# EAGLE design BH_Pzem_WI_FI_SHIELD (EAGLE 8.6.0)
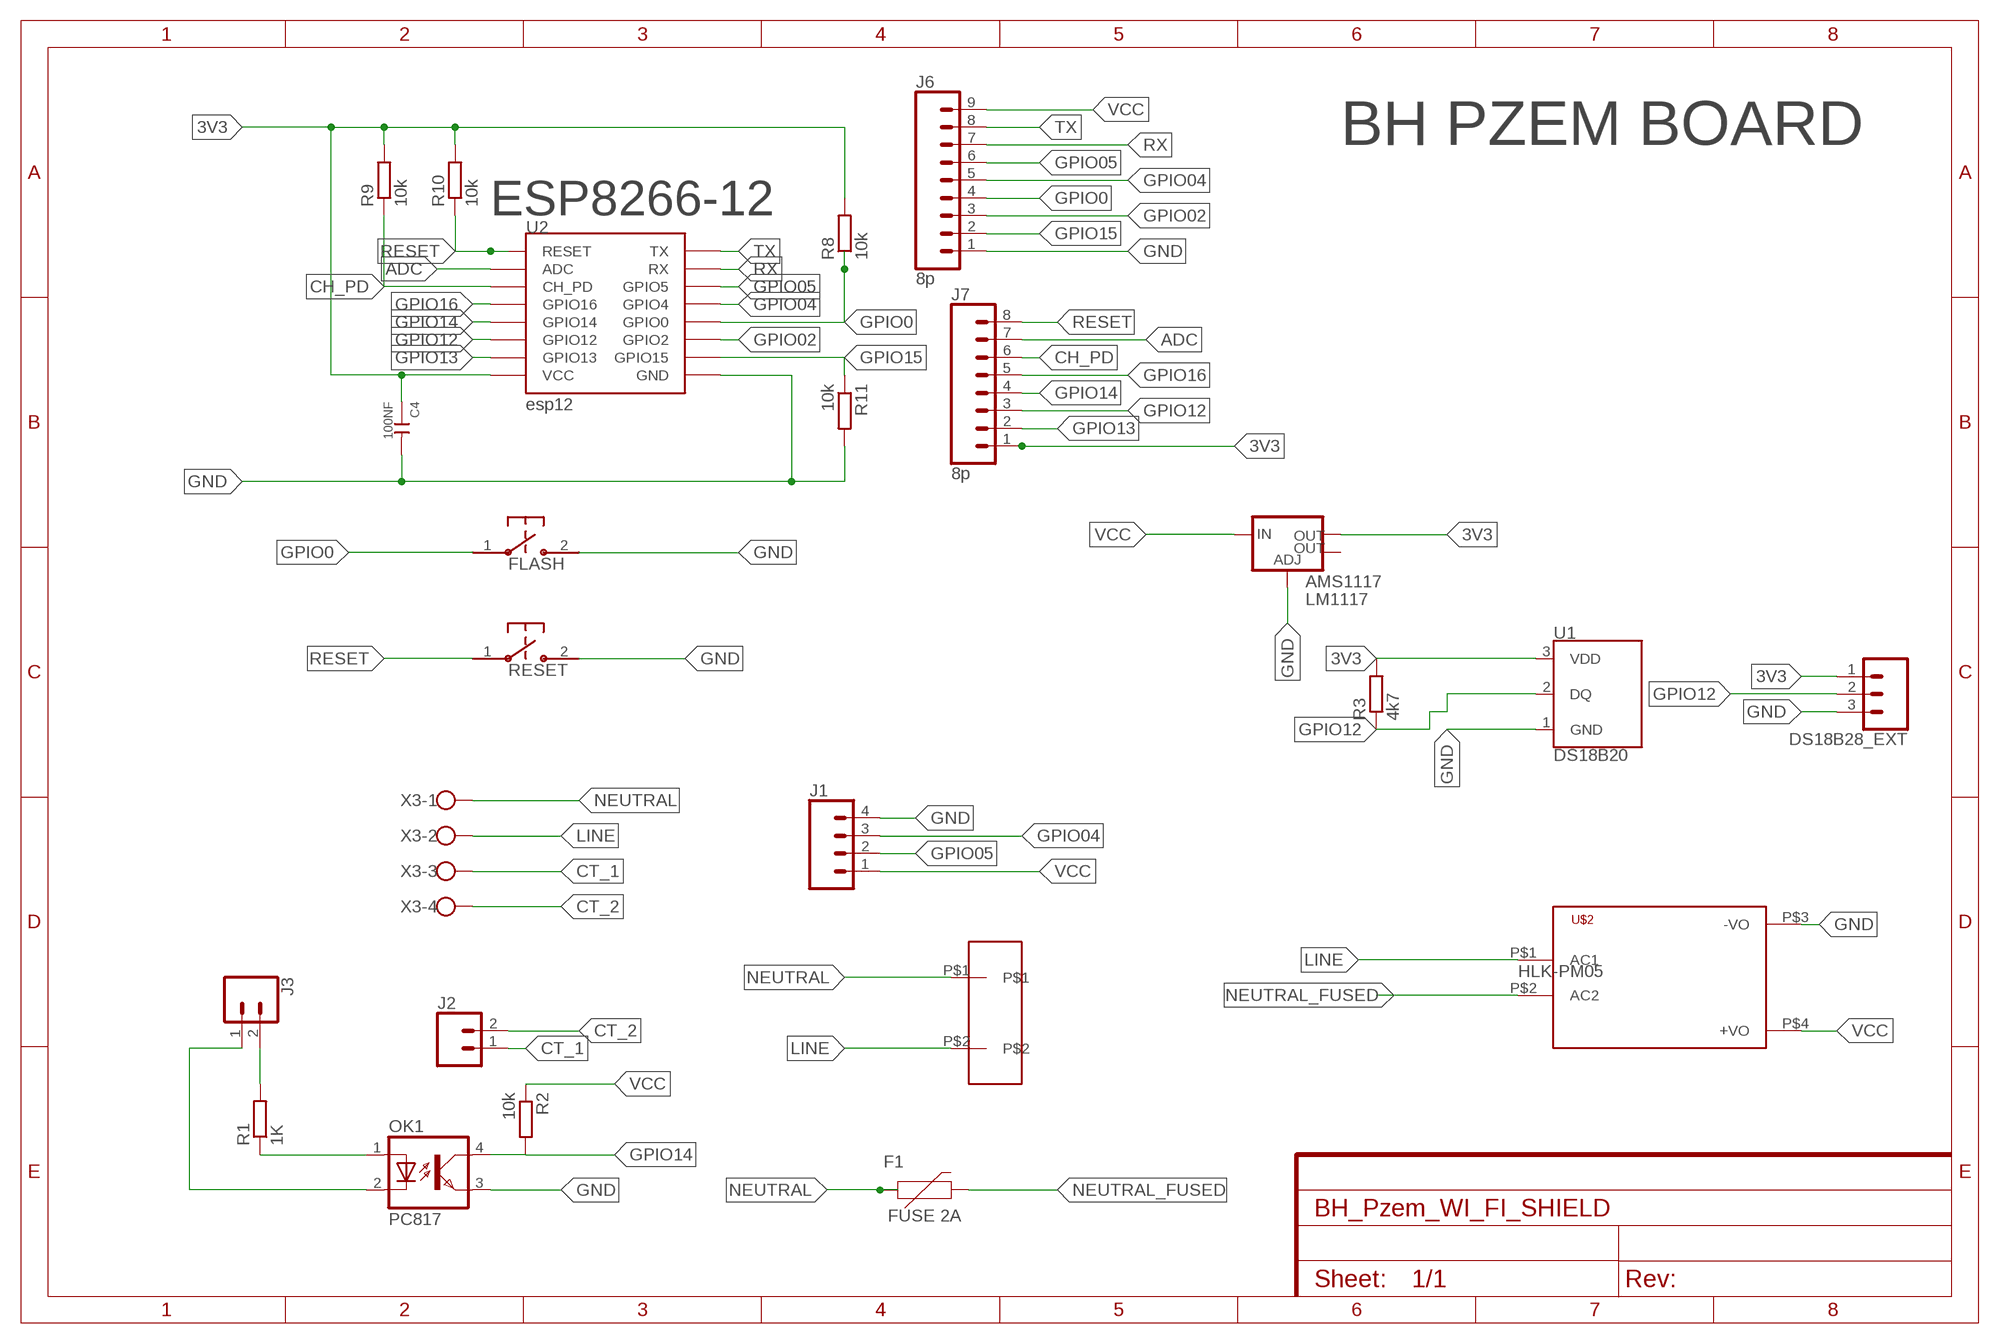
[diagram p0: schematic, sheet 1]

## Parts
AMS1117  LM1117  V_REG_LM1117SOT223  [SOT223]
C4  100NF  CERAMIC-1NF-1KV-10%-X7R(1206)  [C1206]
DS18B28_EXT  CONN_03  [1X03]
F1  FUSE 2A  PPTC_PTH  [PTH]
FLASH  B3U-1000P-2P-SMD  B3U-1000P  [B3U-1000P]
J1  CONN_04  [1X04]
J2  CONN_02  [1X02]
J3  CONN_02  [1X02]
J6  8p  CONN_09  [1X09]
J7  8p  CONN_08"  [1X08]
OK1  PC817  [DIL04]
R1  1K  R-EU_R0603  [R0603]
R2  10k  R-EU_R0603  [R0603]
R3  4k7  R-EU_R0603  [R0603]
R8  10k  R-EU_R0603  [R0603]
R9  10k  R-EU_R0603  [R0603]
R10  10k  R-EU_R0603  [R0603]
R11  10k  R-EU_R0603  [R0603]
RESET  B3U-1000P-2P-SMD  B3U-1000P  [B3U-1000P]
U1  DS18B20  [TO-92-AMMO]
U2  esp12  ESP12SMD  [ESP12-SMD]
U$1  SCREWTERMINALS_5MM_2  [TERMINAL_2X]
U$2  HKLPM01  [HKLPM01]
X3  W237-4  [W237-4]

## Nets
3V3: AMS1117.2(OUT) C4.1 DS18B28_EXT.1 J7.1 R3.2 R8.2 R9.2 R10.2 U1.3(VDD) U2.VCC
ADC: J7.7 U2.ADC
CH_PD: J7.6 R9.1 U2.CH_PD
CT_1: J2.1 X3.3
CT_2: J2.2 X3.4
GND: AMS1117.1(ADJ) C4.2 DS18B28_EXT.3 FLASH.2 J1.4 J6.1 OK1.3(EMIT) R11.2 RESET.2 U1.1(GND) U2.GND U$2.P$3(-VO)
GPIO0: FLASH.1 J6.4 R8.1 U2.GPIO0
GPIO02: J6.3 U2.GPIO2
GPIO04: J1.3 J6.5 U2.GPIO4
GPIO05: J1.2 J6.6 U2.GPIO5
GPIO12: DS18B28_EXT.2 J7.3 R3.1 U1.2(DQ) U2.GPIO12
GPIO13: J7.2 U2.GPIO13
GPIO14: J7.4 OK1.4(COL) R2.2 U2.GPIO14
GPIO15: J6.2 R11.1 U2.GPIO15
GPIO16: J7.5 U2.GPIO16
LINE: U$1.P$2 U$2.P$1(AC1) X3.2
N$1: OK1.1(A) R1.1
N$3: J3.2 R1.2
NEUTRAL [220V]: F1.P$1 U$1.P$1 X3.1
NEUTRAL_FUSED [220V]: F1.P$2 U$2.P$2(AC2)
RESET: J7.8 R10.1 RESET.1 U2.RESET
RX: J6.7 U2.RXD0(RX)
SIGNAL_GND: J3.1 OK1.2(C)
TX: J6.8 U2.TXD0(TX)
VCC: AMS1117.3(IN) J1.1 J6.9 R2.1 U$2.P$4(+VO)
Unconnected: AMS1117.4(OUT)

## Notes on the sheet
- BH PZEM BOARD
- ESP8266-12
- HLK-PM05

## Library data of the parts
AMS1117 = SparkFun-IC-Power:V_REG_LM1117: Voltage Regulator LM1117 Standard adjustable voltage regulator but in SMD form. Spark Fun Electronics SKU : COM-00595; PROD_ID: VREG-08170
C4 = Seeed-Capacitor:CERAMIC-1NF-1KV-10%-X7R?(1206): 302010189; MPN: CC1206KKX7RCBB102; VALUE: 1NF
DS18B28_EXT = SparkFun-Connectors:CONN_03: Multi connection point. Often used as Generic Header-pin footprint for 0.1 inch spaced/style header connections On any of the 0.1 inch spaced packages, you can populate with these: Break Away Headers - Straight <https://www.sparkfun.com/products/116> (PRT-00116) Break Away Male Headers - Right Angle <https://www.sparkfun.com/products/553> (PRT-00553) Female Headers <https://www.sparkfun.com/products/115> (PRT-00115) Break Away Headers - Machine Pin <https://www.sparkfun.com/products/117> (PRT-00117) Break Away Female Headers - Swiss Machine Pin <https://www.sparkfun.com/products/743> (PRT-00743) Stackable Header - 3 Pin (Female, 0.1") <https://www.sparkfun.com/products/13875> (PRT-13875) For SCREWTERMINALS and SPRING TERMINALS visit here: Screw Terimnals on SparkFun.com <https://www.sparkfun.com/search/results?term=Screw+Terminals> (5mm/3.5mm/2.54mm spacing) This device is also useful as a general connection point to wire up your design to another part of your project. Our various solder wires solder well into these plated through hole pads. Hook-Up Wire - Assortment (Stranded, 22 AWG) <https://www.sparkfun.com/products/11375> (PRT-11375) Hook-Up Wire - Assortment (Solid Core, 22 AWG) <https://www.sparkfun.com/products/11367> (PRT-11367) View the entire wire category on our website here <https://www.sparkfun.com/categories/141> Special notes: Molex polarized connector foot print use with SKU : PRT-08232 with associated crimp pins and housings.
F1 = SparkFun-Fuses:PPTC: Resettable Fuse PPTC Resettable Fuse. Really a sort of resistor with a polymeric positive temperature coefficient whose resistance increases dramatically with an increase in temperature. When heated by the power passing through the resistance rises causing the current to be limited, protecting the circuit. This is achieved by the transition of the polymer from a crystalline to an amorphous state where the conductive carbon separates breaking the conductive pathways found in the cool crystalline structure. When a PPTC cools back down it resumes conducting letting the circuit turn back on. SparkFun Products: SparkFun RedBoard - Programmed with Arduino <https://www.sparkfun.com/products/12757> Pro Micro - 5V/16MHz <https://www.sparkfun.com/products/12640> Arduino Pro 328 - 5V/16MHz <https://www.sparkfun.com/products/10915> MP3 Trigger <https://www.sparkfun.com/products/13720>; PROD_ID: RES-08490; VALUE: 72V/0.25A
FLASH = switches:B3U: Switch; DIGIKEY: SW1020CT-ND; MANUFACTURER: Omron; MPN: B3U-1000P; SPICEPREFIX: F
J1 = SparkFun-Connectors:CONN_04: Multi connection point. Often used as Generic Header-pin footprint for 0.1 inch spaced/style header connections On any of the 0.1 inch spaced packages, you can populate with these: Break Away Headers - Straight <https://www.sparkfun.com/products/116> (PRT-00116) Break Away Male Headers - Right Angle <https://www.sparkfun.com/products/553> (PRT-00553) Female Headers <https://www.sparkfun.com/products/115> (PRT-00115) Break Away Headers - Machine Pin <https://www.sparkfun.com/products/117> (PRT-00117) Break Away Female Headers - Swiss Machine Pin <https://www.sparkfun.com/products/743> (PRT-00743) For SCREWTERMINALS and SPRING TERMINALS visit here: Screw Terimnals on SparkFun.com <https://www.sparkfun.com/search/results?term=Screw+Terminals> (5mm/3.5mm/2.54mm spacing) This device is also useful as a general connection point to wire up your design to another part of your project. Our various solder wires solder well into these plated through hole pads. Hook-Up Wire - Assortment (Stranded, 22 AWG) <https://www.sparkfun.com/products/11375> (PRT-11375) Hook-Up Wire - Assortment (Solid Core, 22 AWG) <https://www.sparkfun.com/products/11367> (PRT-11367) View the entire wire category on our website here <https://www.sparkfun.com/categories/141> Special notes: Molex polarized connector foot print use with SKU : PRT-08231 with associated crimp pins and housings. 1MM SMD Version SKU: PRT-10208; PROD_ID: CONN-09696
J2 J3 = SparkFun-Connectors:CONN_02: Multi connection point. Often used as Generic Header-pin footprint for 0.1 inch spaced/style header connections On any of the 0.1 inch spaced packages, you can populate with these: Break Away Headers - Straight <https://www.sparkfun.com/products/116> (PRT-00116) Break Away Male Headers - Right Angle <https://www.sparkfun.com/products/553> (PRT-00553) Female Headers <https://www.sparkfun.com/products/115> (PRT-00115) Break Away Headers - Machine Pin <https://www.sparkfun.com/products/117> (PRT-00117) Break Away Female Headers - Swiss Machine Pin <https://www.sparkfun.com/products/743> (PRT-00743) For SCREWTERMINALS and SPRING TERMINALS visit here: Screw Terimnals on SparkFun.com <https://www.sparkfun.com/search/results?term=Screw+Terminals> (5mm/3.5mm/2.54mm spacing) This device is also useful as a general connection point to wire up your design to another part of your project. Our various solder wires solder well into these plated through hole pads. Hook-Up Wire - Assortment (Stranded, 22 AWG) <https://www.sparkfun.com/products/11375> (PRT-11375) Hook-Up Wire - Assortment (Solid Core, 22 AWG) <https://www.sparkfun.com/products/11367> (PRT-11367) View the entire wire category on our website here <https://www.sparkfun.com/categories/141> Special notes: Molex polarized connector foot print use with: PRT-08233 with associated crimp pins and housings. 2.54_SCREWTERM for use with PRT-10571. 3.5mm Screw Terminal footprints for PRT-08084 5mm Screw Terminal footprints for use with PRT-08432
J6 = SparkFun-Connectors:CONN_09: Multi connection point. Often used as Generic Header-pin footprint for 0.1 inch spaced/style header connections On any of the 0.1 inch spaced packages, you can populate with these: Break Away Headers - Straight <https://www.sparkfun.com/products/116> (PRT-00116) Break Away Male Headers - Right Angle <https://www.sparkfun.com/products/553> (PRT-00553) Female Headers <https://www.sparkfun.com/products/115> (PRT-00115) Break Away Headers - Machine Pin <https://www.sparkfun.com/products/117> (PRT-00117) Break Away Female Headers - Swiss Machine Pin <https://www.sparkfun.com/products/743> (PRT-00743) For SCREWTERMINALS and SPRING TERMINALS visit here: Screw Terimnals on SparkFun.com <https://www.sparkfun.com/search/results?term=Screw+Terminals> (5mm/3.5mm/2.54mm spacing) This device is also useful as a general connection point to wire up your design to another part of your project. Our various solder wires solder well into these plated through hole pads. Hook-Up Wire - Assortment (Stranded, 22 AWG) <https://www.sparkfun.com/products/11375> (PRT-11375) Hook-Up Wire - Assortment (Solid Core, 22 AWG) <https://www.sparkfun.com/products/11367> (PRT-11367) View the entire wire category on our website here <https://www.sparkfun.com/categories/141> Special notes: Molex polarized connector foot print use with SKU : PRT-08231 with associated crimp pins and housings. 1MM SMD Version SKU: PRT-10208 NOTES ON THE VARIANTS LOCK and LOCK_LONGPADS... This footprint was designed to help hold the alignment of a through-hole component (i.e. 6-pin header) while soldering it into place. You may notice that each hole has been shifted either up or down by 0.005 of an inch from it's more standard position (which is a perfectly straight line). This slight alteration caused the pins (the squares in the middle) to touch the edges of the holes. Because they are alternating, it causes a "brace" to hold the component in place. 0.005 has proven to be the perfect amount of "off-center" position when using our standard breakaway headers. Although looks a little odd when you look at the bare footprint, once you have a header in there, the alteration is very hard to notice. Also,if you push a header all the way into place, it is covered up entirely on the bottom side.
J7 = SparkFun-Connectors:CONN_08: Multi connection point. Often used as Generic Header-pin footprint for 0.1 inch spaced/style header connections On any of the 0.1 inch spaced packages, you can populate with these: Break Away Headers - Straight <https://www.sparkfun.com/products/116> (PRT-00116) Break Away Male Headers - Right Angle <https://www.sparkfun.com/products/553> (PRT-00553) Female Headers <https://www.sparkfun.com/products/115> (PRT-00115) Break Away Headers - Machine Pin <https://www.sparkfun.com/products/117> (PRT-00117) Break Away Female Headers - Swiss Machine Pin <https://www.sparkfun.com/products/743> (PRT-00743) Arduino Stackable Header - 8 Pin <https://www.sparkfun.com/products/9279> (PRT-09279) For SCREWTERMINALS and SPRING TERMINALS visit here: Screw Terimnals on SparkFun.com <https://www.sparkfun.com/search/results?term=Screw+Terminals> (5mm/3.5mm/2.54mm spacing) This device is also useful as a general connection point to wire up your design to another part of your project. Our various solder wires solder well into these plated through hole pads. Hook-Up Wire - Assortment (Stranded, 22 AWG) <https://www.sparkfun.com/products/11375> (PRT-11375) Hook-Up Wire - Assortment (Solid Core, 22 AWG) <https://www.sparkfun.com/products/11367> (PRT-11367) View the entire wire category on our website here <https://www.sparkfun.com/categories/141> Special notes: Molex polarized connector foot print use with SKU : PRT-08231 with associated crimp pins and housings. 1MM SMD Version SKU: PRT-10208 NOTES ON THE VARIANTS LOCK and LOCK_LONGPADS... This footprint was designed to help hold the alignment of a through-hole component (i.e. 6-pin header) while soldering it into place. You may notice that each hole has been shifted either up or down by 0.005 of an inch from it's more standard position (which is a perfectly straight line). This slight alteration caused the pins (the squares in the middle) to touch the edges of the holes. Because they are alternating, it causes a "brace" to hold the component in place. 0.005 has proven to be the perfect amount of "off-center" position when using our standard breakaway headers. Although looks a little odd when you look at the bare footprint, once you have a header in there, the alteration is very hard to notice. Also,if you push a header all the way into place, it is covered up entirely on the bottom side.; PROD_ID: CONN-08438
OK1 = optocoupler:PC817: SHARP OPTO COUPLER; MPN: PC817X4J000F; OC_FARNELL: 9707727; OC_NEWARK: 97K7059
R1-R3 R8-R11 = resistor:R-EU_: RESISTOR, European symbol
RESET = switches:B3U: Switch; DIGIKEY: SW1020CT-ND; MANUFACTURER: Omron; MPN: B3U-1000P
U1 = SparkFun-Sensors:DS18B20: Dallas/Maxim DS18B20 1-Wire Temperature Sensor The DS18B20 reports degrees C with 9 to 12-bit precision, -55C to 125C (+/-0.5C). Each sensor has a unique 64-Bit Serial number etched into it - allows for a huge number of sensors to be used on one data bus. Datasheet <http://datasheets.maximintegrated.com/en/ds/DS18B20.pdf> SparkFun Products One Wire Digital Temperature Sensor - DS18B20 <https://www.sparkfun.com/products/245> (SEN-00245); STORE_ID: SEN-00245
U2 = esp8266modules:ESP12: ESP8266 Wifi module 12
U$1 = captain-slow:SCREWTERMINALS_5MM_2
U$2 = HKLPM01:HKLPM01
X3 = con-wago-500:W237-4: WAGO SCREW CLAMP; OC_FARNELL: unknown; OC_NEWARK: unknown

## Net classes
1 220V: width 1.27 mm, clearance 2 mm

## Board
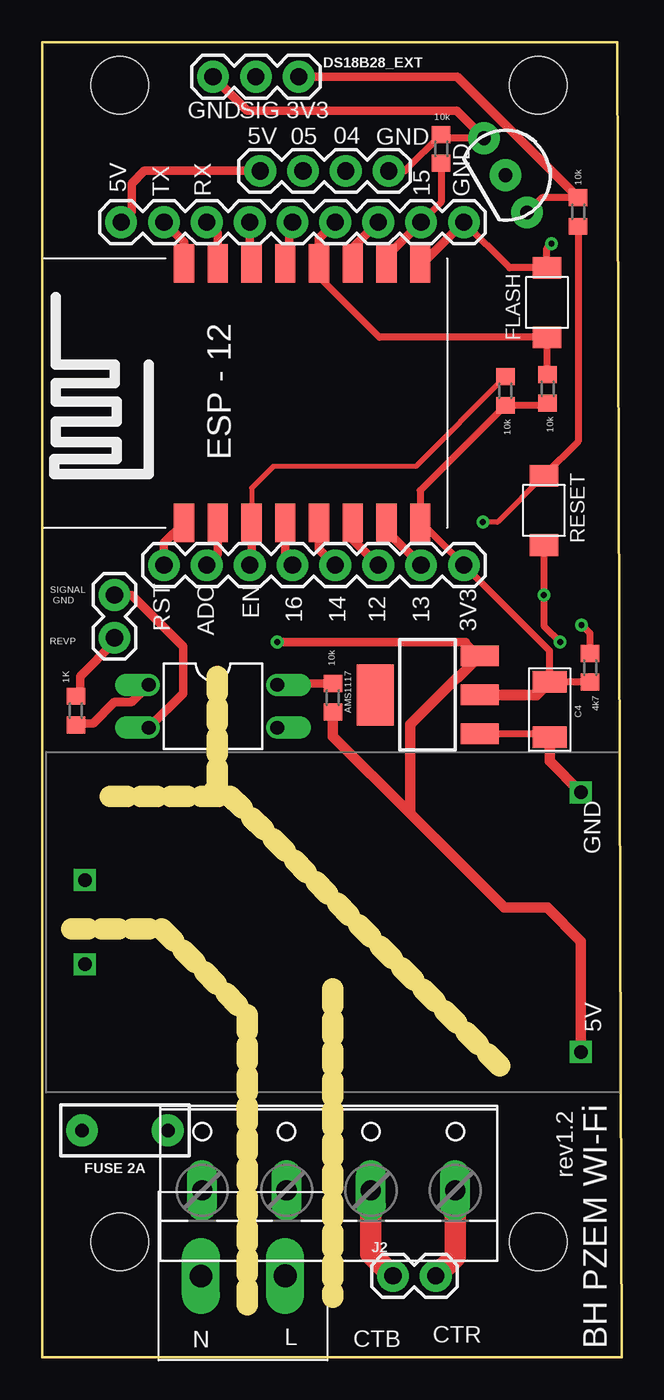
[diagram p1: board, top side]
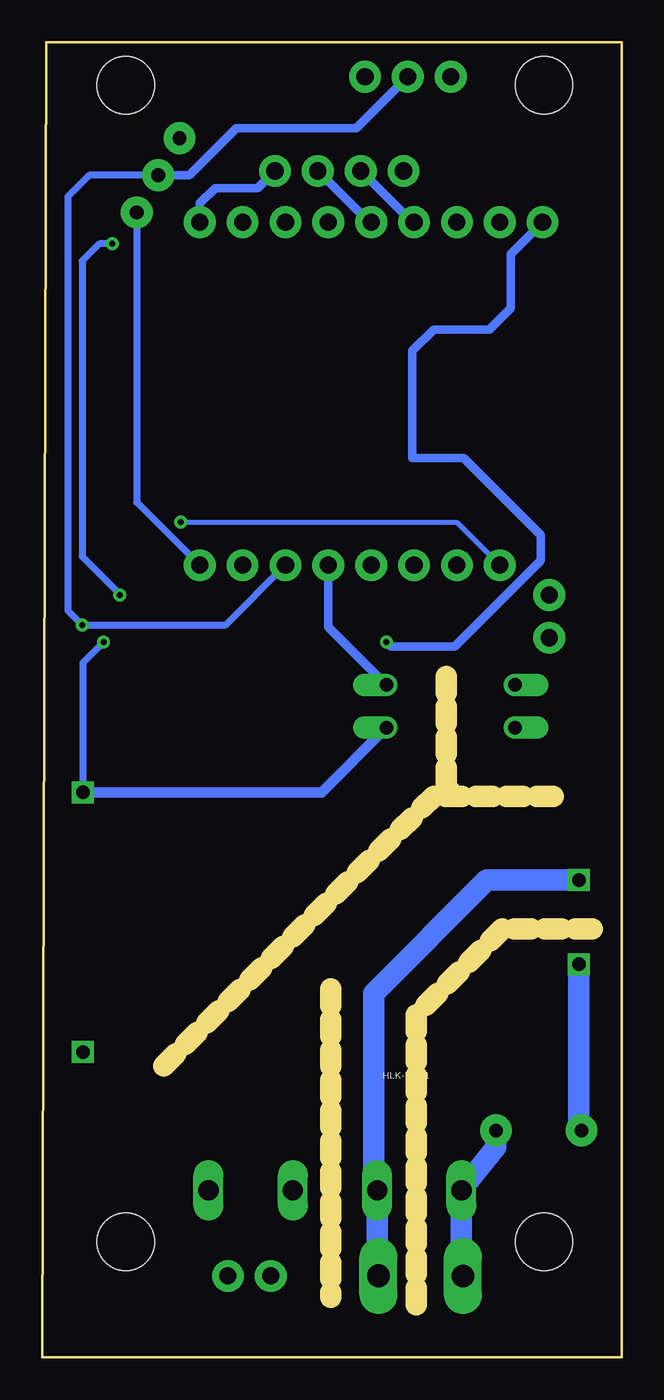
[diagram p2: board, bottom side, seen from below]

Size 34.34 x 77.99 mm. Coordinates in mm from the lower left corner, seen from the top.
Outline: 0,0 0,77.99 34.09,77.99 34.34,0 0,0
Copper layers (1*16): Top 0.035mm / dielectric 1.5mm / Bottom 0.035mm
Design rules "default": minimum track width 6mil, minimum drill 0.35mm, track to track 6mil, track to pad 6mil, pad to pad 6mil, via to via 6mil, smd to smd 6mil, copper to edge 40mil, drill to drill 6mil, minimum pad ring 10mil, minimum via ring 8mil, stop-mask expansion 4mil, vias tented up to drill 0mil, thermal gap 10mil
Holes 3.39 mm at 4.6,6.85 29.4,6.85 29.4,75.44 4.6,75.44
Milling: 50 lines

### Footprints (pad centres in the part's own frame; a part is rotated, then mirrored left to right if it is on the bottom)
SOT223 = smd 1.219 x 2.235: 1 -2.311,-3.099; 2 0,-3.099; 3 2.311,-3.099 | smd 3.6 x 2.2: 4 0,3.099
C1206 = smd 1.27 x 2.032: 1 -1.651,0; 2 1.651,0
1X03 = drill 1.016 pad 1.88: 1 0,0; 2 2.54,0; 3 5.08,0
PTH = drill 0.8 pad 1.88: P$1 -2.54,0; P$2 2.54,0
B3U-1000P = smd 1.283 x 1.7: 1 -2.056,0; 2 2.056,0
1X04 = drill 1.016 pad 1.88: 1 0,0; 2 2.54,0; 3 5.08,0; 4 7.62,0
1X02 = drill 1.016 pad 1.88: 1 0,0; 2 2.54,0
1X09 = drill 1.016 pad 1.88: 1 0,0; 2 2.54,0; 3 5.08,0; 4 7.62,0; 5 10.16,0; 6 12.7,0; 7 15.24,0; 8 17.78,0; 9 20.32,0
1X08 = drill 1.016 pad 1.88: 1 0,0; 2 2.54,0; 3 5.08,0; 4 7.62,0; 5 10.16,0; 6 12.7,0; 7 15.24,0; 8 17.78,0
DIL04 = drill 0.813 offset: 1 -1.27,-3.81; 2 1.27,-3.81; 3 1.27,3.81; 4 -1.27,3.81
R0603 = smd 1 x 1.1: 1 -0.85,0; 2 0.85,0
TO-92-AMMO = drill 0.813 pad 1.88: 1 -2.54,0; 2 0,0; 3 2.54,0
ESP12-SMD = smd 2.286 x 1.2: ADC -7.792,3.8; CH_PD -7.792,1.8; GND 7.592,-8.2; GPIO0 7.592,-2.2; GPIO2 7.592,-4.2; GPIO4 7.592,-0.2; GPIO5 7.592,1.8; GPIO12 -7.792,-4.2; GPIO13 -7.792,-6.2; GPIO14 -7.792,-2.2; GPIO15 7.592,-6.2; GPIO16 -7.792,-0.2; RESET -7.792,5.8; RXD0 7.592,3.8; TXD0 7.592,5.8; VCC -7.792,-8.2
TERMINAL_2X = drill 1.329 pad 2.254 long: P$1 0,2.5 | drill 1.354 pad 2.254 long: P$2 0,-2.5
HKLPM01 = drill 0.8 square: P$1 -14.7,2.5; P$2 -14.7,-2.5; P$3 14.7,7.7; P$4 14.7,-7.7
W237-4 = drill 1.194 long: 1 -7.5,-1.27; 2 -2.5,-1.27; 3 2.5,-1.27; 4 7.5,-1.27

### Placement (x,y rotation side)
AMS1117  22.84,39.29 90 top
C4  30.09,38.42 270 top
DS18B28_EXT  15.21,75.95 180 top
F1  4.91,13.46 180 top
FLASH  29.93,62.55 90 top
J1  12.92,70.36 0 top
J2  20.8,4.83 0 top
J3  4.29,45.21 270 top
J6  25,67.31 180 top
J7  25,46.98 180 top
OK1  10.13,38.61 270 top
R1  2,38.35 90 top
R2  17.24,39.12 90 top
R3  32.48,40.89 270 top
R8  29.96,57.43 270 top
R9  27.46,57.3 270 top
R10  31.78,67.92 90 top
R11  23.65,71.66 90 top
RESET  29.74,50.22 270 top
U1  27.47,70.1 300 top
U2  14.21,57.28 90 top
U$1  11.91,4.83 90 top
U$2  17.23,25.8 0 top
X3  16.99,11.18 0 top

### Tracks (layer width: path | path; a pad name or v marks a point on that pad's centre or on a via)
3V3
  Top 0.254: AMS1117.2 26.13,39.28 | 26.13,39.28 29.3,39.28 | 25.96,39.12 26.13,39.28
  Top 0.406: R3.2 30.11,40.04 C4.1 30.09,41.89 J7.1 22.49,49.49 U2.VCC 22.41,51.4 R9.2 29.84,56.45 R8.2 | R10.2 29.6,68.77 U1.3
  Top 0.508: DS18B28_EXT.1 24.6,75.95 R10.2
  Top 0.61: C4.1 29.3,39.28 AMS1117.2
  Bottom 0.406: U1.3 28.74,50.72 J7.1
ADC
  Top 0.254: 9.76,46.99 J7.7
  Top 0.508: U2.ADC 10.41,47.64 9.76,46.99
CH_PD
  Top 0.254: U2.CH_PD 12.41,48.26 12.41,47.09
  Top 0.305: R9.1 22.14,52.83 13.68,52.83 12.41,51.56 12.41,48.26
  Top 0.508: J7.6 12.41,47.09 U2.CH_PD
CT_1
  Top 1.27: X3.3 19.49,6.14 J2.1
CT_2
  Top 1.27: X3.4 24.49,5.98 J2.2
GND  (via drill 0.35)
  Top 0.406: C4.2 29.88,36.97 AMS1117.1 | J1.4 21.5,70.36 R11.2 23.85,72.3 U1.1 | J6.1 27.71,64.61 FLASH.2 29.93,65.77 v30.19,66.04 | RESET.2 v29.74,45.21 29.74,43.38 v30.7,42.42
  Top 0.508: J6.1 22.56,64.87 U2.GND | DS18B28_EXT.3 12.16,73.91 24.59,73.91 U1.1
  Top 0.61: U$2.P$3 30.09,35.35 C4.2
  Bottom 0.406: v30.7,42.42 31.93,41.19 U$2.P$3 | v30.19,66.04 30.96,66.04 31.97,65.02 31.97,47.5 29.74,45.27 v29.74,45.21
  Bottom 0.508: J1.4 21.56,69.34 24.1,69.34 25,68.44 J6.1
  Bottom 0.61: U$2.P$3 17.77,33.5 OK1.3
GPIO0
  Top 0.305: U2.GPIO0 16.41,65.28 16.41,66.34
  Top 0.406: 16.41,65.28 16.41,64.08 19.99,60.5 FLASH.1 29.93,58.32 R8.1
  Top 0.508: U2.GPIO0 16.41,66.34 J6.4
GPIO02
  Top 0.508: U2.GPIO2 18.41,65.8 J6.3
GPIO04
  Top 0.305: 14.64,67.12 J6.5
  Top 0.508: U2.GPIO4 14.64,65.1 14.64,67.12
  Bottom 0.508: J6.5 14.96,67.31 J1.3
GPIO05
  Top 0.305: 12.39,64.89 U2.GPIO5
  Top 0.508: J6.6 12.3,64.98 12.39,64.89
  Bottom 0.508: J6.6 12.42,67.31 J1.2
GPIO12  (via drill 0.35)
  Top 0.406: R3.1 32.48,42.93 v31.97,43.43
  Top 0.508: U2.GPIO12 18.41,48.49 J7.3
  Bottom 0.406: J7.3 23.46,43.43 v31.97,43.43 32.82,44.29 32.82,68.83 31.55,70.1 U1.2
  Bottom 0.508: DS18B28_EXT.2 15.72,72.9 22.83,72.9 25.62,70.1 U1.2
GPIO13
  Top 0.508: U2.GPIO13 20.41,49.03 J7.2
GPIO14
  Top 0.254: OK1.4 14.03,39.97 14.45,39.97
  Top 0.508: R2.2 14.45,39.97 | U2.GPIO14 16.41,47.95 J7.4
  Bottom 0.508: OK1.4 17.38,43.32 J7.4
GPIO15
  Top 0.406: R11.1 23.65,68.5 J6.2
  Top 0.508: U2.GPIO15 20.41,65.26 J6.2
GPIO16
  Top 0.508: U2.GPIO16 14.41,47.41 J7.5
LINE
  Bottom 1.27: U$2.P$1 7.99,28.3 14.7,21.59 14.7,10.12 X3.2 14.49,4.91 U$1.P$2
N$1
  Top 0.254: 2.51,37.59 2.42,37.5 R1.1
  Top 0.508: 2.51,37.59 3.02,37.59 4.29,38.86 5.3,38.86 OK1.1
N$3
  Top 0.508: J3.2 4.29,42.42 2.25,40.39 2.25,39.46 R1.2
NEUTRAL
  Bottom 1.27: F1.P$1 7.45,12.45 X3.1 9.49,4.91 U$1.P$1
NEUTRAL_FUSED
  Bottom 1.27: F1.P$2 2.53,14.13 U$2.P$2
RESET  (via drill 0.35)
  Top 0.305: RESET.1 26.99,49.53 v26.13,49.53
  Top 0.406: R10.1 31.78,54.31 RESET.1
  Top 0.508: U2.RESET 7.22,48.3 J7.8
  Bottom 0.305: v26.13,49.53 9.77,49.53 J7.8
RX
  Top 0.254: 10.41,65.02 U2.RXD0
  Top 0.508: J6.7 10.41,66.66 10.41,65.02
SIGNAL_GND
  Top 0.508: J3.1 5.3,45.21 8.35,42.16 8.35,39.37 OK1.2
TX
  Top 0.508: J6.8 8.41,66.12 U2.TXD0
VCC  (via drill 0.35)
  Top 0.406: 25.12,42.42 AMS1117.3
  Top 0.508: J1.1 6.06,70.36 5.3,69.6 5.3,67.94 J6.9 | v13.94,42.42 25.12,42.42
  Top 0.61: R2.1 17.24,36.83 21.81,32.26 | U$2.P$4 31.93,24.68 29.94,26.67 27.4,26.67 21.81,32.26 | AMS1117.3 24.7,40.35 24.64,40.35 21.81,37.53 21.81,32.26
  Bottom 0.508: J6.9 6.57,65.42 6.57,62.23 7.84,60.96 11.14,60.96 12.41,59.69 12.41,53.34 9.37,53.34 4.79,48.77 4.79,47.24 9.87,42.16 13.68,42.16 v13.94,42.42

### Text on the board
tNames: GND | SIG | 3V3 | 5V | 05 | 04 | GND | 5V | TX | RX | 15 | GND | SIGNAL / GND | EN | 16 | 14 | 12 | 13 | REVP | RST | ADC | 3V3 | GND | 5V | rev1.2 | CTB | N | L | CTR | BH PZEM WI-Fi
bNames: HLK-PM01